# Altium schematic sheet Sheet_1_2020-05-12_13-00-15.schdoc
size 105 x 97 mm
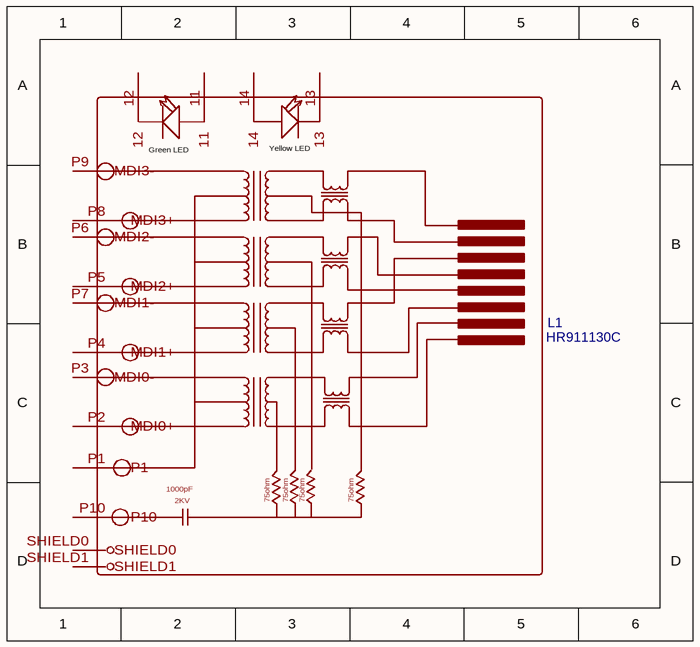
[diagram p0: Sheet_1_2020-05-12_13-00-15.schdoc]

## Parts
L1  HR911130C  [RJ45-TH_HR911130C]

## Nets

Not connected (* = marked no-connect by the designer): L1 11 12 13 14 P1 P2(MDI0+) P3(MDI0-) P4(MDI1+) P5(MDI2+) P6(MDI2-) P7(MDI1-) P8(MDI3+) P9(MDI3-) P10 SHIELD0 SHIELD1

## Notes on the sheet
- (in symbol HR911130C) Green LED; Yellow LED; J8; J7; J6 RX-; J5; J4; J3 RX+; J2 TX-; J1 TX+; 1000pF; 75ohm; 2KV

## Library data of the parts
L1 = HR911130C: BOM_Manufacturer: HANRUN; nameAlias: Value; Contributor: LCSC; BOM_Supplier: LCSC; BOM_Manufacturer Part: HR911130C; BOM_Supplier Part: C50933; spicePre: L; spiceSymbolName: HR911130C